# EasyEDA Pro project jlcProject.epro, board PCB1_1
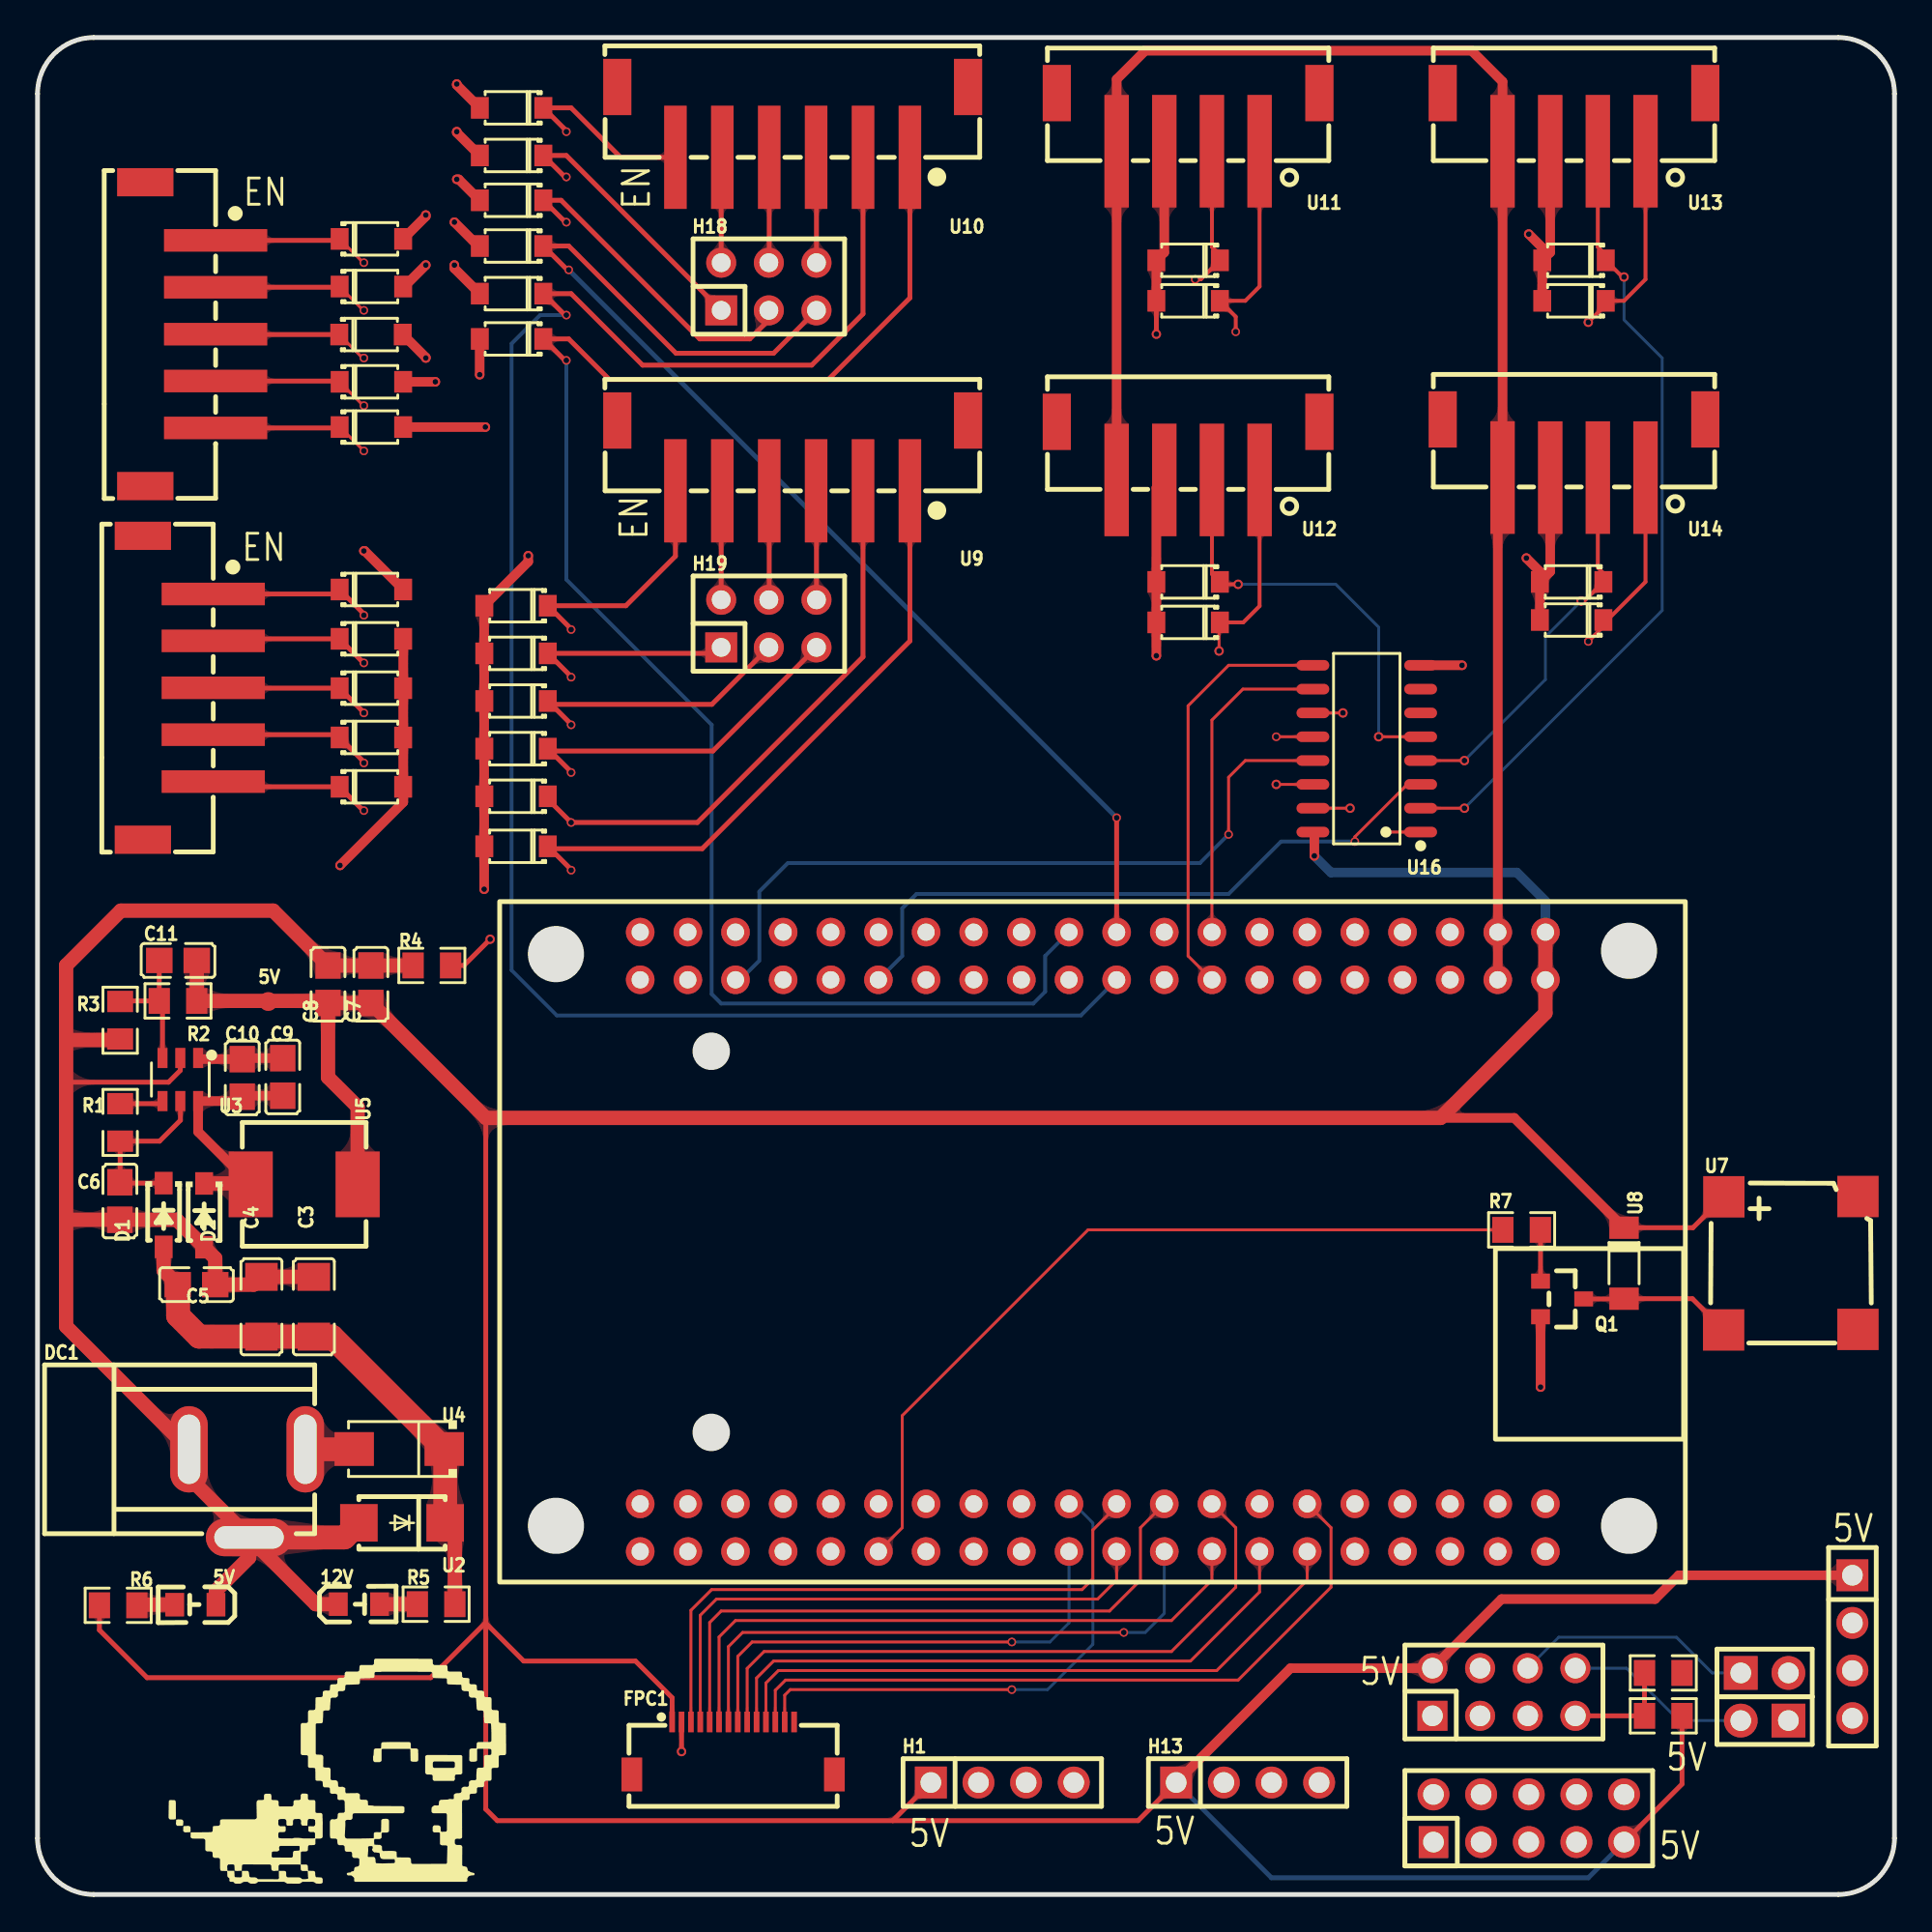
[diagram p13: board, top side]
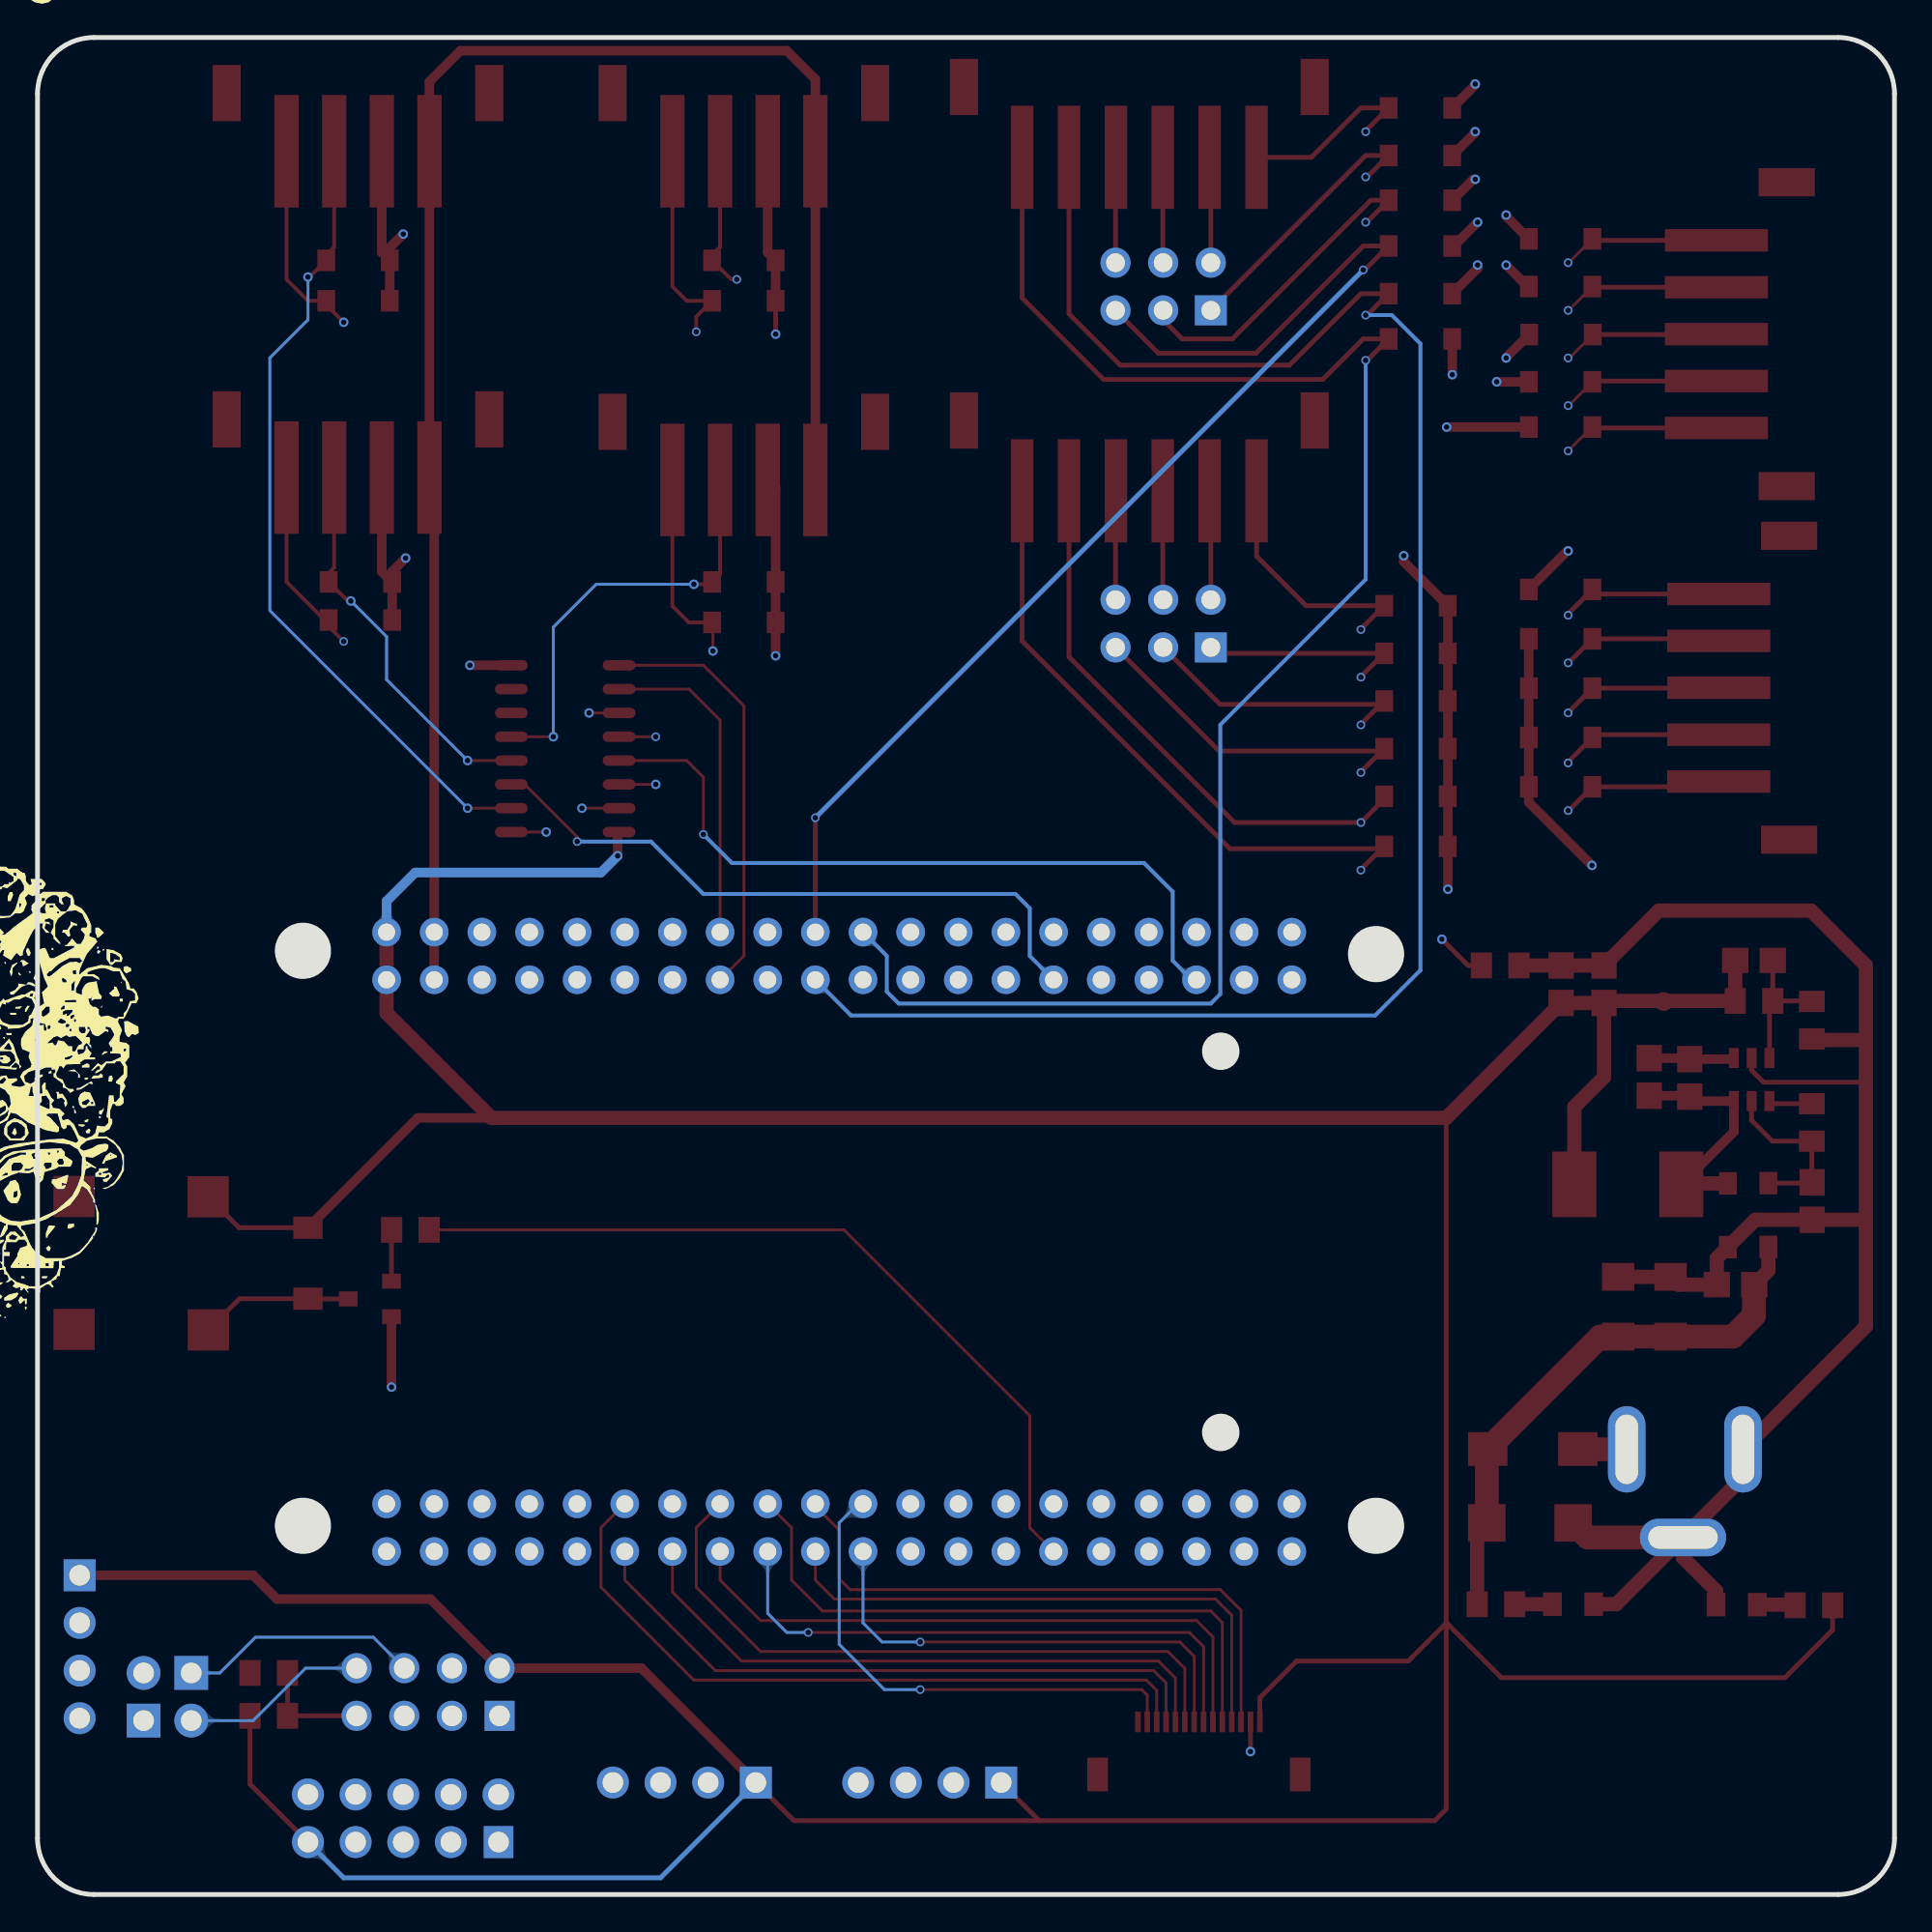
[diagram p14: board, bottom side, seen from below]

Outline 99 x 99 mm; copper layers: Top Layer, Inner1, Inner2, Bottom Layer. Coordinates in mm from the lower left corner of the outline.
Outline path: 0,96 0,3 arc(0.88,0.88) 3,0 96,0 arc(98.12,0.88) 99,3 99,96 arc(98.12,98.12) 96,99 3,99 arc(0.88,98.12) 0,96
Stack: Top Layer 0.035mm 外层铜厚1oz / Dielectric1 0.2104mm 7628 RC49% 8.6mil / Inner1 0.0152mm 内层铜厚 / Dielectric2 1.065mm 1.1mm H/HOZ 含铜 / Inner2 0.0152mm 内层铜厚 / Dielectric3 0.2104mm 7628 RC49% 8.6mil / Bottom Layer 0.035mm 外层铜厚1oz

## Design rules (mm)
template: 自定义配置
spacing copperThickness1oz (default): track to track 0.102, other pairs 0.152 to 0.3
spacing copperThickness2oz: track to track 0.203, other pairs 0.152 to 0.3
track width copperThickness1oz (default): min 0.127, default 0.254, max 2.54
track width copperThickness2oz: min 0.203, default 0.254, max 2.54
differential pair differentialPair (default): width min 0.127, default 0.254, max 2.54; gap min 0.152, default 0.152
via viaSize (default): diameter min 0.5, default 0.61, max 10; hole min 0.3, default 0.305, max 6.299
via viaSize1: diameter min 0.127, default 0.305, max 10; hole min 0.102, default 0.457, max 6.299
net D2 uses viaSize1
net C10 uses viaSize1
net C8 uses viaSize1
net B4 uses viaSize1
net D7 uses viaSize1
net D5 uses viaSize1
net D0 uses viaSize1
net C0 uses viaSize1
net C2 uses viaSize1
net A10 uses viaSize1
net A11 uses viaSize1
net C12 uses viaSize1
net C11 uses viaSize1
net C9 uses viaSize1
net E3 uses viaSize1
net A8 uses viaSize1
net B5 uses viaSize1
net B3 uses viaSize1
net D6 uses viaSize1
net D4 uses viaSize1
net D1 uses viaSize1
net C1 uses viaSize1
net C3 uses viaSize1
net A9 uses viaSize1
net A12 uses viaSize1
net A0 uses viaSize1
net A2 uses viaSize1
net C4 uses viaSize1
net B0 uses viaSize1
net E9 uses viaSize1
net E11 uses viaSize1
net E13 uses viaSize1
net B11 uses viaSize1
net B13 uses viaSize1
net B15 uses viaSize1
net D9 uses viaSize1
net A1 uses viaSize1
net A3 uses viaSize1
net A5 uses viaSize1
net A7 uses viaSize1
net C5 uses viaSize1
net B1 uses viaSize1
net E8 uses viaSize1
net E10 uses viaSize1
net E12 uses viaSize1
net E14 uses viaSize1
net B10 uses viaSize1
net B12 uses viaSize1
net B14 uses viaSize1
net D8 uses viaSize1
net CTP_INT uses viaSize1
net A15 uses viaSize1
net WIFI_TXD uses viaSize1
net WIFI_CS uses viaSize1
net WIFI_RXD uses viaSize1
net MOTOR1_M1 uses viaSize1
net MOTOR1_M0 uses viaSize1
net MOTOR1_M2 uses viaSize1
net MOTOR2_M1 uses viaSize1
net MOTOR2_M0 uses viaSize1
net MOTOR2_M2 uses viaSize1
net 1Y0 uses viaSize1
net 2Y0 uses viaSize1
net D10 uses viaSize1
net 1Y2 uses viaSize1
net 1Y3 uses viaSize1
net 1Y1 uses viaSize1
net 2Y2 uses viaSize1
net 2Y1 uses viaSize1
net 2Y3 uses viaSize1

## Placement (name value [footprint] x y rotation side)
5V  -  [LED_0805]  8.36 15.46 180 top
5V#2  -  [Mark-Point-1mm]  12.3 47.61 270 top
12V  -  [LED_0805]  17.19 15.47 0 top
C3  100uf  [C1206]  14.73 31.33 270 top
C4  100uf  [C1206]  11.94 31.33 270 top
C5  100nF  [C0805]  8.47 32.51 180 top
C6  10uF  [C0805]  4.39 36.97 270 top
C7  10uF  [C0805]  17.77 48.53 270 top
C8  100nF  [C0805]  15.49 48.53 270 top
C9  100nF  [C0805]  13.07 43.58 270 top
C10  100nF  [C0805]  10.92 43.53 270 top
C11  100pF  [C0805]  7.49 49.8 0 top
CN1  ZX-XH2.54-5PLT  [CONN-SMD_5P-P2.50_ZX-XH2.54-5PLT]  7.49 64.33 270 top
CN2  ZX-XH2.54-5PLT  [CONN-SMD_5P-P2.50_ZX-XH2.54-5PLT]  7.62 83.19 270 top
D1  B5819W SL  [SOD-123_L2.7-W1.6-LS3.7-RD-1]  6.72 36.22 270 top
D2  B5819W SL  [SOD-123_L2.7-W1.6-LS3.7-RD-1]  8.88 36.21 270 top
D3  SMF3.3A  [SOD-123_L2.8-W1.8-LS3.7-RD]  25.51 55.88 180 top
D4  SMF3.3A  [SOD-123_L2.8-W1.8-LS3.7-RD]  25.51 58.55 180 top
D5  SMF3.3A  [SOD-123_L2.8-W1.8-LS3.7-RD]  25.51 61.09 180 top
D6  SMF3.3A  [SOD-123_L2.8-W1.8-LS3.7-RD]  25.27 82.93 180 top
D7  SMF3.3A  [SOD-123_L2.8-W1.8-LS3.7-RD]  25.27 85.34 180 top
D8  SMF3.3A  [SOD-123_L2.8-W1.8-LS3.7-RD]  25.27 87.88 180 top
D21  SMF3.3A  [SOD-123_L2.8-W1.8-LS3.7-RD]  25.51 63.63 180 top
D22  SMF3.3A  [SOD-123_L2.8-W1.8-LS3.7-RD]  25.51 66.17 180 top
D23  SMF3.3A  [SOD-123_L2.8-W1.8-LS3.7-RD]  25.51 68.71 180 top
D24  SMF3.3A  [SOD-123_L2.8-W1.8-LS3.7-RD]  25.27 90.32 180 top
D25  SMF3.3A  [SOD-123_L2.8-W1.8-LS3.7-RD]  25.27 92.71 180 top
D26  SMF3.3A  [SOD-123_L2.8-W1.8-LS3.7-RD]  25.27 95.25 180 top
D27  SMF3.3A  [SOD-123_L2.8-W1.8-LS3.7-RD]  17.8 69.57 0 top
D28  SMF3.3A  [SOD-123_L2.8-W1.8-LS3.7-RD]  17.8 66.94 0 top
D29  SMF3.3A  [SOD-123_L2.8-W1.8-LS3.7-RD]  17.8 64.31 0 top
D30  SMF3.3A  [SOD-123_L2.8-W1.8-LS3.7-RD]  17.8 61.68 0 top
D31  SMF3.3A  [SOD-123_L2.8-W1.8-LS3.7-RD]  17.8 59.06 0 top
D32  SMF3.3A  [SOD-123_L2.8-W1.8-LS3.7-RD]  17.8 88.27 0 top
D33  SMF3.3A  [SOD-123_L2.8-W1.8-LS3.7-RD]  17.8 85.72 0 top
D34  SMF3.3A  [SOD-123_L2.8-W1.8-LS3.7-RD]  17.78 83.17 0 top
D35  SMF3.3A  [SOD-123_L2.8-W1.8-LS3.7-RD]  17.8 80.64 0 top
D36  SMF3.3A  [SOD-123_L2.8-W1.8-LS3.7-RD]  17.8 78.23 0 top
D37  SMF3.3A  [SOD-123_L2.8-W1.8-LS3.7-RD]  61.34 84.96 180 top
D38  SMF3.3A  [SOD-123_L2.8-W1.8-LS3.7-RD]  61.34 87.12 180 top
D39  SMF3.3A  [SOD-123_L2.8-W1.8-LS3.7-RD]  61.34 67.82 180 top
D40  SMF3.3A  [SOD-123_L2.8-W1.8-LS3.7-RD]  61.34 69.98 180 top
D41  SMF3.3A  [SOD-123_L2.8-W1.8-LS3.7-RD]  81.91 84.96 180 top
D42  SMF3.3A  [SOD-123_L2.8-W1.8-LS3.7-RD]  81.91 87.12 180 top
D43  SMF3.3A  [SOD-123_L2.8-W1.8-LS3.7-RD]  81.79 67.94 180 top
D44  SMF3.3A  [SOD-123_L2.8-W1.8-LS3.7-RD]  81.79 69.98 180 top
DC1  DC005  [DC-IN-TH_DC005]  11.18 21.38 0 top
FPC1  FPC-05F-14PH15  [FPC-SMD_14P-P0.50_XUNPU_FPC-05F-14PH15]  37.08 7.8 0 top
H1  -  [HDR-TH_4P-P2.54-V-F]  51.44 5.97 0 top
H2  -  [HDR-TH_8P-P2.54-V-F-R2-C4-S2.54-1]  78.18 10.79 0 top
H4  -  [HDR-TH_2P-P2.54-V-M-1]  92.07 9.27 180 top
H5  -  [HDR-TH_2P-P2.54-V-M-1]  92.07 11.81 0 top
H12  -  [HDR-TH_4P-P2.54-V-F]  96.76 13.21 270 top
H13  -  [HDR-TH_4P-P2.54-V-F]  64.52 5.97 0 top
H14  -  [HDR-TH_10P-P2.54-V-F-R2-C5-S2.54]  79.5 4.06 0 top
H18  -  [HDR-TH_6P-P2.54-V-F-R2-C3-S2.54]  38.99 85.72 0 top
H19  -  [HDR-TH_6P-P2.54-V-F-R2-C3-S2.54]  38.99 67.75 0 top
Q1  -  [S8050_SOT-23]  81.28 31.88 180 top
R1  1M  [R0805]  4.41 41.16 90 top
R2  10K  [R0805]  7.49 47.64 0 top
R3  1.8K  [R0805]  4.41 46.61 90 top
R4  0  [R0805]  21.02 49.53 0 top
R5  1.2K  [R0805]  21.25 15.48 180 top
R6  510  [R0805]  4.3 15.42 0 top
R7  470  [R0805]  79.12 35.43 0 top
R8  10K  [R0805]  86.67 11.81 0 top
R9  10K  [R0805]  86.67 9.53 0 top
U1  -  [STM32H750VBT6]  24.64 16.66 0 top
U2  SMAJ15A  [DO-214AC_L4.6-W2.8-LS5.6-RD]  19.43 19.81 180 top
U3  ME3116AM6G  [SOT-23-6_L2.9-W1.6-P0.95-LS2.8-BL]  7.61 43.45 180 top
U4  SS54  [SMA_L4.2-W2.6-LS5.1-RD]  19.28 23.75 180 top
U5  6.8uH  [IND-SMD_L7.2-W6.6_GPSR07X0]  14.22 37.86 0 top
U7  MLT-8530-5V  [BUZ-SMD_4P-L8.5-W8.5-TL]  93.47 33.66 0 top
U8  LL4148  [LL-34_L3.5-W1.5-R-RD]  84.58 33.66 270 top
U9  ZX-XH2.54-6PLT  [CONN-SMD_6P-P2.50_ZX-XH2.54-6PLT]  40.26 76.71 180 top
U10  ZX-XH2.54-6PLT  [CONN-SMD_6P-P2.50_ZX-XH2.54-6PLT]  40.26 94.49 180 top
U11  ZX-XH2.54-4PLT  [CONN-SMD_4P-P2.54_C9900012758]  61.34 94.49 180 top
U12  ZX-XH2.54-4PLT  [CONN-SMD_4P-P2.54_C9900012758]  61.34 76.96 180 top
U13  ZX-XH2.54-4PLT  [CONN-SMD_4P-P2.54_C9900012758]  81.91 94.49 180 top
U14  ZX-XH2.54-4PLT  [CONN-SMD_4P-P2.54_C9900012758]  81.91 77.09 180 top
U16  74HC4052  [SOP-16_L10.0-W3.9-P1.27-LS6.0-BL]  70.87 61.09 90 top

## Footprints (pads in the part's own frame, mm; a bottom-side part is the same pattern mirrored in y, then rotated)
BUZ-SMD_4P-L8.5-W8.5-TL
  rect 2.2x2.2 smd: 1(-3.568,3.541) 2(-3.581,-3.557) 3(3.58,-3.528) 4(3.581,3.557)
C0805
  rect 1.41x1.35 smd: 1(-1,0) 2(1,0)
C1206
  rect 1.485x1.728 smd: 1(-1.593,0) 2(1.593,0)
CONN-SMD_4P-P2.54_C9900012758
  rect 1.3x6 smd: 1(-3.811,1.55) 2(-1.27,1.55) 3(1.27,1.55) 4(3.81,1.55)
  rect 1.5x3 smd: 5(7,-1.55) 6(-7,-1.55)
CONN-SMD_5P-P2.50_ZX-XH2.54-5PLT
  rect 1.2x5.5 smd: 1(-5,1.875) 2(-2.5,1.875) 3(0,1.875) 4(2.5,1.875) 5(5,1.875)
  rect 1.5x3 smd: 6(8.1,-1.875) 7(-8.1,-1.875)
CONN-SMD_6P-P2.50_ZX-XH2.54-6PLT
  rect 1.2x5.5 smd: 1(-6.25,1.875) 2(-3.75,1.875) 3(-1.25,1.875) 4(1.25,1.875) 5(3.75,1.875) 6(6.25,1.875)
  rect 1.5x3 smd: 7(9.35,-1.875) 8(-9.35,-1.875)
DC-IN-TH_DC005
  oval 2x4.6 hole 1.2x3.7: 1(3.1,2.35) 2(-3.1,2.35)
  oval 4.6x2 hole 3.7x1.2: 3(0.1,-2.35)
DO-214AC_L4.6-W2.8-LS5.6-RD
  rect 2x2 smd: 1(-2.3,0) 2(2.3,0)
FPC-SMD_14P-P0.50_XUNPU_FPC-05F-14PH15
  rect 0.3x1.1 smd: 1(-3.25,1.4) 2(-2.75,1.4) 3(-2.25,1.4) 4(-1.75,1.4) 5(-1.25,1.4) 6(-0.75,1.4) 7(-0.25,1.4) 8(0.25,1.4) 9(0.75,1.4) 10(1.25,1.4) 11(1.75,1.4) 12(2.25,1.4) 13(2.75,1.4) 14(3.25,1.4)
  rect 1.1x1.8 smd: 15(5.4,-1.4) 16(-5.4,-1.4)
HDR-TH_2P-P2.54-V-M-1
  rect 1.8x1.8 hole 1.1: 1(-1.27,0)
  round 1.8 hole 1.1: 2(1.27,0)
HDR-TH_4P-P2.54-V-F
  rect 1.7x1.7 hole 1.1: 1(-3.81,0)
  round 1.7 hole 1.1: 2(-1.27,0) 3(1.27,0) 4(3.81,0)
HDR-TH_6P-P2.54-V-F-R2-C3-S2.54
  rect 1.7x1.6 hole 1: 1(-2.54,-1.27)
  round 1.6 hole 1: 2(-2.54,1.27) 3(0,-1.27) 4(0,1.27) 5(2.54,-1.27) 6(2.54,1.27)
HDR-TH_8P-P2.54-V-F-R2-C4-S2.54-1
  rect 1.6x1.6 hole 1.1: 1(-3.81,-1.27)
  round 1.6 hole 1.1: 2(-3.81,1.27) 3(-1.27,-1.27) 4(-1.27,1.27) 5(1.27,-1.27) 6(1.27,1.27) 7(3.81,-1.27) 8(3.81,1.27)
HDR-TH_10P-P2.54-V-F-R2-C5-S2.54
  rect 1.575x1.7 hole 1.1: 1(-5.08,-1.27)
  round 1.7 hole 1.1: 2(-5.08,1.27) 3(-2.54,-1.27) 4(-2.54,1.27) 5(0,-1.27) 6(0,1.27) 7(2.54,-1.27) 8(2.54,1.27) 9(5.08,-1.27) 10(5.08,1.27)
IND-SMD_L7.2-W6.6_GPSR07X0
  rect 2.35x3.5 smd: 1(-2.85,0) 2(2.85,0)
LED_0805
  rect 1x1.25 smd: 1(-1.15,0.005) 2(1.05,0.005)
LL-34_L3.5-W1.5-R-RD
  rect 1.185x1.566 smd: 1(1.893,0) 2(-1.893,0)
Mark-Point-1mm
  round 1 smd: 1(0,0)
R0805
  rect 1.133x1.377 smd: 1(-1,0) 2(1,0)
S8050_SOT-23
  rect 1x0.8 smd: 1(1.15,-0.823) 2(1.15,1.077) 3(-1.15,0.127)
SMA_L4.2-W2.6-LS5.1-RD
  rect 2.1x1.8 smd: 1(-2.4,0) 2(2.4,0)
SOD-123_L2.7-W1.6-LS3.7-RD-1
  rect 1.2x0.95 smd: 1(-1.7,0) 2(1.7,0)
SOD-123_L2.8-W1.8-LS3.7-RD
  rect 0.95x1.15 smd: 1(-1.692,0) 2(1.692,0)
SOP-16_L10.0-W3.9-P1.27-LS6.0-BL
  oval 0.56x1.745 smd: 1(-4.445,-2.873) 2(-3.175,-2.873) 3(-1.905,-2.873) 4(-0.635,-2.873) 5(0.635,-2.873) 6(1.905,-2.873) 7(3.175,-2.873) 8(4.445,-2.873) 9(4.445,2.873) 10(3.175,2.873) 11(1.905,2.873) 12(0.635,2.873) 13(-0.635,2.873) 14(-1.905,2.873) 15(-3.175,2.873) 16(-4.445,2.873)
SOT-23-6_L2.9-W1.6-P0.95-LS2.8-BL
  rect 0.532x1.072 smd: 1(-0.95,-1.149) 2(0,-1.149) 3(0.95,-1.149) 4(0.95,1.149) 5(0,1.149) 6(-0.95,1.149)
STM32H750VBT6
  round 1.524 hole 0.914: 1(7.493,1.63) 2(10.033,1.63) 3(12.573,1.63) 4(15.113,1.63) 5(17.653,1.63) 6(20.193,1.63) 7(22.733,1.63) 8(25.273,1.63) 9(27.813,1.63) 10(30.353,1.63) 11(32.893,1.63) 12(35.433,1.63) 13(37.973,1.63) 14(40.513,1.63) 15(43.053,1.63) 16(45.593,1.63) 17(48.133,1.63) 18(50.673,1.63) 19(53.213,1.63) 20(55.753,1.63) 21(55.753,4.17) 22(53.213,4.17) 23(50.673,4.17) 24(48.133,4.17) 25(45.593,4.17) 26(43.053,4.17) 27(40.513,4.17) 28(37.973,4.17) 29(35.433,4.17) 30(32.893,4.17) 31(30.353,4.17) 32(27.813,4.17) 33(25.273,4.17) 34(22.733,4.17) 35(20.193,4.17) 36(17.653,4.17) 37(15.113,4.17) 38(12.573,4.17) 39(10.033,4.17) 40(7.493,4.17) 41(7.493,34.65) 42(10.033,34.65) 43(12.573,34.65) 44(15.113,34.65) 45(17.653,34.65) 46(20.193,34.65) 47(22.733,34.65) 48(25.273,34.65) 49(27.813,34.65) 50(30.353,34.65) 51(32.893,34.65) 52(35.433,34.65) 53(37.973,34.65) 54(40.513,34.65) 55(43.053,34.65) 56(45.593,34.65) 57(48.133,34.65) 58(50.673,34.65) 59(53.213,34.65) 60(55.753,34.65) 61(55.753,32.11) 62(53.213,32.11) 63(50.673,32.11) 64(48.133,32.11) 65(45.593,32.11) 66(43.053,32.11) 67(40.513,32.11) 68(37.973,32.11) 69(35.433,32.11) 70(32.893,32.11) 71(30.353,32.11) 72(27.813,32.11) 73(25.273,32.11) 74(22.733,32.11) 75(20.193,32.11) 76(17.653,32.11) 77(15.113,32.11) 78(12.573,32.11) 79(10.033,32.11) 80(7.493,32.11)

## Nets
As in the schematic, except:
5V: 5V#2.1 C7.2 C8.2 C11.2 FPC1.1 H1.1 H2.2 H12.1 H13.1 H14.9 R2.2 R6.1 R9.2 U1.60 U1.61 U5.2 U7.1 U8.2 U16.16
AGND: 5V.1 12V.1 C3.1 C4.1 C5.1 C6.2 C7.1 C8.1 D2.2 DC1.2 DC1.3 R3.1 R4.1 U2.2 U3.2
GND: D3.2 D4.2 D5.2 D6.2 D7.2 D8.2 D21.2 D22.2 D23.2 D24.2 D25.2 D26.2 D27.2 D28.2 D29.2 D30.2 D31.2 D32.2 D33.2 D34.2 D35.2 D36.2 D37.2 D38.2 D39.2 D40.2 D41.2 D42.2 D43.2 D44.2 FPC1.2 H1.2 H2.4 H12.2 H13.2 H14.7 H14.8 Q1.2 R4.2 R8.2 U1.20 U1.21 U11.3 U12.3 U13.3 U14.3 U16.6 U16.7 U16.8
1Y0: D38.1 U11.2 U16.1
1Y1: D40.1 U12.2 U16.5
1Y2: D42.1 U13.2 U16.2
1Y3: D44.1 U14.2 U16.4
2Y0: D37.1 U11.1 U16.12
2Y1: D39.1 U12.1 U16.14
2Y2: D41.1 U13.1 U16.15
2Y3: D43.1 U14.1 U16.11
A8: U1.75 U16.3
C9: U1.78 U16.13
D0: U1.53 U16.10
D1: U1.68 U16.9
$1N4630: 5V.2 R6.2

Pads without a net: CN1 6 7; CN2 6 7; FPC1 14 15 16; H14 2; U1 1 2 3 22 27 34 35 38 39 40 44 45 46 47 48 52 57 64 73 74 76; U7 3 4; U9 7 8; U10 7 8; U11 5 6; U12 5 6; U13 5 6; U14 5 6

## Via types
v1: diameter 0.457, hole 0.305, Top Layer to Bottom Layer, 32 vias
v2: diameter 0.5, hole 0.305, Top Layer to Bottom Layer, 18 vias
v3: diameter 0.5, hole 0.299, Top Layer to Bottom Layer, 18 vias

## Routing (per net, layer and track width the routed paths; a pad name or vN(x,y) marks a point on that pad's centre or on a via; arc(x,y) is an arc through that point)
3.3V: length 91.2
  Top Layer w0.508: U1.62 U1.59 77.85,75.28 U14.4 U13.4 78.1,96.65 76.45,98.3 59.06,98.3 57.53,96.77 U11.4 U12.4
5V: length 318.1
  Top Layer w0.254: U7.1 88.25,35.55 U8.2 ; 45.59,3.94 24.51,3.94 23.9,4.55 23.9,14.47 ; 45.59,3.94 58.67,3.94 H13.1 ; 45.59,3.94 H1.1 ; FPC1.1 33.83,10.49 31.88,12.45 25.92,12.45 23.9,14.47 ; 23.9,41.4 23.9,14.47 ; 23.9,14.47 23.86,14.47 20.95,11.56 5.84,11.56 3.3,14.1 R6.1 ; H14.9 87.67,5.88 R9.2
  Top Layer w0.508: H13.1 66.8,12.06 H2.2 78.05,15.75 86.23,15.75 87.5,17.02 H12.1 ; U8.2 78.73,41.4 74.8,41.4 ; v2(68.07,55.37) 68.07,56.62
  Top Layer w0.762: U1.60 U1.61 80.39,46.99 74.8,41.4 23.9,41.4 C7.2 C8.2 ; U5.2 17.07,41.99 15.49,43.57 C8.2 ; C8.2 15.38,47.64 R2.2 C11.2
  Bottom Layer w0.254: H14.9 82.68,0.89 65.79,0.89 H13.1
  Bottom Layer w0.508: U1.60 80.39,52.96 78.87,54.48 68.96,54.48 v2(68.07,55.37)
12V: length 29.6
  Top Layer w0.762: R5.1 22.25,19.3 U2.1 ; D1.2 6.72,33.26 C5.2
  Top Layer w1.27: U2.1 21.73,23.7 U4.1 15.69,29.74 C3.2 C4.2 8.61,29.74 7.49,30.86 7.49,32.49 C5.2
AGND: length 97.7
  Top Layer w0.254: 1.52,43.3 6.98,43.3 7.61,43.93 U3.2
  Top Layer w0.762: DC1.3 8.08,22.23 DC1.2 1.52,30.29 1.52,36 ; DC1.3 11.28,17.96 9.51,16.19 5V.1 ; DC1.3 14.83,15.48 12V.1 ; R4.1 20.02,49.53 C7.1 C8.1 12.56,52.45 4.44,52.45 1.52,49.53 1.52,45.55 ; R3.1 4.35,45.55 1.52,45.55 ; 1.52,45.55 1.52,36 ; C3.1 C4.1 11.52,32.51 C5.1 9.47,33.92 D2.2 7.42,35.97 C6.2 1.55,35.97 1.52,36
  Top Layer w1.27: DC1.3 16.36,19.03 17.13,19.81
GND: length 106.6
  Top Layer w0.254: D37.2 v2(59.65,83.19) ; FPC1.2 v3(34.33,7.62) ; R4.2 22.73,49.53 v3(24.13,50.93)
  Top Layer w0.508: D42.2 80.65,87.54 U13.3 ; D42.2 80.22,87.8 v2(79.5,88.52) ; D42.2 D41.2 ; D43.2 D44.2 ; D44.2 80.1,70.53 v2(79.38,71.25) ; D44.2 80.65,70.53 U14.3 ; v3(16.13,54.86) 19.5,58.23 19.5,66.94 ; v3(22.35,93.98) 22.35,93.93 23.57,92.71 ; 23.57,90.32 22.46,91.44 v3(22.35,91.44) ; 19.5,88.27 20.7,89.47 v3(20.7,89.53) ; 19.48,83.17 20.7,81.94 v3(20.7,81.92) ; v3(23.81,53.59) 23.81,68.71 26.16,71.06 v3(26.16,71.37) ; 23.57,95.25 22.35,96.47 v3(22.35,96.52) ; v2(59.65,66.04) D39.2 D40.2 59.65,74.99 U12.3 ; 19.5,78.23 v3(23.88,78.23) ; 23.57,85.34 22.22,86.69 v3(22.22,86.87) ; D37.2 D38.2 60.07,87.54 U11.3 ; 73.63,65.53 v2(75.95,65.53) ; Q1.2 v3(80.13,27.05) ; 19.5,85.72 19.56,85.72 v3(20.7,86.87) ; 19.5,80.64 v3(21.21,80.64) ; 23.57,87.88 23.5,87.88 v3(22.22,89.15) ; v3(17.4,71.63) 17.44,71.63 19.5,69.57 ; 23.57,82.93 v3(23.57,81.03)
1Y0: length 47
  Top Layer w0.152: v2(71.88,56.64) U16.1
  Top Layer w0.203: U11.2 62.61,87.83 63.03,87.41 D38.1 62.02,86.11 v1(61.72,86.11)
  Inner2 w0.152: v1(61.72,86.11) 61.09,85.47 61.09,61.98 66.42,56.64 v2(71.88,56.64)
1Y1: length 23.2
  Top Layer w0.152: U16.5 v2(71.5,61.72)
  Top Layer w0.203: v2(64.01,69.85) 63.16,69.85 D40.1 62.61,70.4 U12.2
  Bottom Layer w0.152: v2(64.01,69.85) 69.22,69.85 71.5,67.56 v2(71.5,61.72)
1Y2: length 43.2
  Top Layer w0.152: U16.2 v2(76.07,57.91)
  Top Layer w0.203: U13.2 83.19,87.83 83.61,87.41 D42.1 84.5,86.23 v2(84.58,86.23)
  Bottom Layer w0.152: v2(84.58,86.23) 84.58,83.95 86.61,81.92 86.61,68.45 v2(76.07,57.91)
1Y3: length 20.7
  Top Layer w0.152: U16.4 v2(76.07,60.45)
  Top Layer w0.203: U14.2 83.19,70.74 83.48,70.44 D44.1 82.46,68.96 v2(82.3,68.96)
  Bottom Layer w0.152: v2(76.07,60.45) 80.39,64.77 80.39,67.06 v2(82.3,68.96)
2Y0: length 36.1
  Top Layer w0.152: U16.12 v1(66.04,61.72)
  Top Layer w0.203: U11.1 65.15,85.73 64.39,84.96 D37.1 63.88,84.12 v1(63.88,83.31)
  Inner1 w0.152: v1(63.88,83.31) 63.88,74.51 65.15,73.24 65.15,62.61 v1(66.04,61.72)
2Y1: length 21.1
  Top Layer w0.152: U16.14 v2(66.04,59.18) ; D39.1 62.99,67.78 v2(62.99,66.29)
  Top Layer w0.203: D39.1 64.28,67.82 65.15,68.69 U12.1
  Inner1 w0.152: v2(62.99,66.29) 62.99,62.23 v2(66.04,59.18)
2Y2: length 46.5
  Top Layer w0.152: v2(69.98,57.91) U16.15
  Top Layer w0.203: v2(82.68,83.82) 83.61,84.75 D41.1 84.58,84.96 85.72,86.11 85.72,92.94
  Inner1 w0.152: v2(82.68,83.82) 78.61,83.82 70.36,75.56 70.36,58.29 v2(69.98,57.91)
2Y3: length 26
  Top Layer w0.152: v2(69.6,62.99) U16.11
  Top Layer w0.203: 85.72,75.54 85.72,69.98 83.69,67.94 D43.1 ; v1(82.68,66.8) 83.48,67.61
  Inner2 w0.152: v1(82.68,66.8) 78.87,62.99 v2(69.6,62.99)
A0: length 54.9
  Top Layer w0.254: v1(17.4,57.78) 17.37,57.78 16.1,59.06 9.65,59.06 CN1.5
  Inner1 w0.254: v1(17.4,57.78) 17.4,46.74 39.75,24.38 U1.37
A1: length 61
  Top Layer w0.254: CN1.4 15.95,61.83 17.4,60.38 v1(17.4,60.33)
  Inner1 w0.254: U1.4 41.02,19.56 41.02,24.64 18.16,47.5 18.16,59.56 v1(17.4,60.33)
A2: length 61.1
  Top Layer w0.254: CN1.3 9.39,64.31 16.1,64.31 17.4,63.01 v1(17.4,62.99)
  Inner1 w0.254: U1.36 42.29,24.64 19.05,47.88 19.05,61.34 v1(17.4,62.99)
A3: length 67.4
  Top Layer w0.254: v1(17.4,65.66) 17.38,65.66 16.1,66.94 9.48,66.94 CN1.2
  Inner1 w0.254: U1.5 42.41,18.28 43.56,19.43 43.56,24.77 20.07,48.26 20.07,62.99 v1(17.4,65.66)
A5: length 115
  Top Layer w0.152: R7.1 56.01,35.43 46.1,25.53 46.1,19.56 U1.6
  Top Layer w0.254: CN1.1 15.86,69.33 16.1,69.57 17.4,68.27 v1(17.4,68.2)
  Inner1 w0.254: v1(17.4,68.2) 20.95,64.64 20.95,48.89 46.1,23.75 46.1,19.56 U1.6
A7: length 81.8
  Top Layer w0.152: v1(17.4,76.96) 16.13,78.23 16.1,78.23 16.05,78.19
  Top Layer w0.254: 16.05,78.19 CN2.5
  Inner2 w0.254: U1.7 46.23,19.43 46.23,22.1 44.58,23.75 40.77,23.75 18.8,45.72 18.8,75.56 v1(17.4,76.96)
A8: length 34.9
  Top Layer w0.152: v1(70.23,56.13) 70.23,56.39 73.03,59.18 U16.3
  Bottom Layer w0.203: v1(70.23,56.13) 66.29,56.13 63.5,53.34 46.86,53.34 46.1,52.58 46.1,50.03 U1.75
A9: length 43.6
  Inner2 w0.152: H13.4 68.33,8.57 68.96,9.2 68.96,28.32 70.23,29.59 U1.65
A10: length 48.1
  Inner1 w0.152: H13.3 65.79,5.21 65.91,5.08
  Inner2 w0.152: U1.56 68.96,50.03 68.96,45.59 66.42,43.05 66.42,9.4 65.79,8.76 H13.3
A11: length 54.7
  Inner1 w0.152: U1.58 75.31,51.31 74.04,50.04 74.04,46.86 53.72,26.54 53.72,8.89 52.71,7.87 H1.3
A12: length 51.1
  Inner1 w0.152: H1.4 55.25,7.75 56.13,8.64 56.13,25.02 75.31,44.2 U1.63
A15: length 14.7
  Inner2 w0.152: U1.19 77.85,18.28 80.77,15.37 80.77,6.6 H14.6
B0: length 85.3
  Top Layer w0.152: 16.06,80.69 17.37,79.38 v1(17.4,79.38)
  Top Layer w0.254: CN2.4 16.06,80.69
  Inner2 w0.254: U1.32 48.13,25.15 41.66,25.15 20.32,46.48 20.32,76.45 v1(17.4,79.38)
B1: length 91.7
  Top Layer w0.152: 16.08,83.17 17.33,81.92 v1(17.4,81.92) ; 9.51,83.17 CN2.3
  Top Layer w0.254: 16.08,83.17 9.51,83.17
  Inner2 w0.254: v1(17.4,81.92) 21.72,77.6 21.72,47.62 42.8,26.54 49.78,26.54 53.72,22.61 53.72,19.56 U1.9
B3: length 72.1
  Top Layer w0.254: v1(28.19,93.98) 28.19,94.03 26.97,95.25 28.45,95.25 31.09,92.61 U10.6
  Inner1 w0.254: v1(28.19,93.98) 32.77,89.41 32.77,62.99 34.67,61.09 44.7,61.09 53.72,52.07 53.72,50.03 U1.71
B4: length 72.1
  Top Layer w0.254: v1(28.19,89.15) 28.14,89.15 26.97,90.32 27.91,90.32 35.31,82.93 37.97,82.93 38.99,83.95 H18.3
  Inner1 w0.254: U1.49 52.33,51.31 43.43,60.2 32.51,60.2 31.62,61.09 31.62,85.72 v1(28.19,89.15)
B5: length 73.3
  Top Layer w0.254: H18.1 28.19,92.71 26.97,92.71 28.12,91.57 v1(28.19,91.57)
  Inner2 w0.254: U1.72 51.18,50.03 51.18,52.32 49.53,53.97 39.5,53.97 33.15,60.33 33.15,86.61 v1(28.19,91.57)
B10: length 33.2
  Top Layer w0.152: U1.14 65.15,16.13 61.47,12.45 39.24,12.45 38.33,11.54 FPC1.10
B11: length 38.6
  Top Layer w0.152: U1.26 68.96,19.56 68.96,16.38 64.01,11.43 39.88,11.43 39.33,10.89 FPC1.12
B12: length 34.7
  Top Layer w0.152: U1.15 67.69,16.76 62.87,11.94 39.5,11.94 38.83,11.28 FPC1.11
B13: length 22.5
  Inner1 w0.152: 75.69,10.74 75.69,12.83 71.5,17.02 71.5,19.56 U1.25 ; 75.69,10.74 H2.3 ; 75.69,10.74 75.69,4.06 H14.3
B14: length 23.1
  Inner1 w0.152: H14.1 70.23,6.99 70.23,13.66 ; H2.1 70.23,13.66 ; 70.23,13.66 U1.16
B15: length 22.5
  Inner2 w0.152: 78.23,10.74 78.23,4.19 79.5,2.92 H14.5 ; 78.23,10.74 H2.5 ; 78.23,10.74 78.23,12.83 74.04,17.02 74.04,19.56 72.77,20.82 U1.24
C4: length 85.5
  Top Layer w0.152: v1(17.4,84.45) 17.37,84.45 16.1,85.72 16.06,85.69
  Top Layer w0.254: CN2.2 16.06,85.69
  Inner1 w0.254: U1.33 49.91,21.46 21.72,49.66 21.72,78.61 17.4,82.93 v1(17.4,84.45)
C5: length 91.8
  Top Layer w0.152: 16.1,88.27 17.37,87 v1(17.4,87) ; 15.93,88.31 16.1,88.14
  Top Layer w0.254: CN2.1 15.93,88.19
  Inner1 w0.254: U1.8 50.03,18.28 51.18,19.43 51.18,21.59 22.61,50.17 22.61,81.79 v1(17.4,87)
C8: length 42.4
  Top Layer w0.254: 27.34,58.42 27.34,58.26 v1(28.45,57.15) 35.18,57.15 44.01,65.98 U9.2
  Inner1 w0.203: U1.43 37.21,53.72 33.78,57.15 v1(28.45,57.15)
C9: length 39.6
  Top Layer w0.152: U16.13 64.39,60.45 63.5,59.56 v1(63.5,56.52)
  Bottom Layer w0.203: U1.78 37.46,48.77 38.48,49.78 38.48,53.47 40,54.99 61.98,54.99 v1(63.5,56.52)
C10: length 33.5
  Top Layer w0.254: H19.5 36,60.96 27.34,60.96 ; 27.34,60.96 27.21,60.96 ; 27.34,60.96 27.21,61.09 ; 27.34,60.96 28.45,59.85 v1(28.45,59.82)
  Inner1 w0.254: v1(28.45,59.82) 27.56,58.93 27.56,54.61 28.19,53.97 33.78,53.97 34.67,53.09 U1.42
C11: length 35.5
  Top Layer w0.254: 27.21,63.63 27.39,63.45 ; 27.39,63.45 27.21,63.45 ; 27.39,63.45 28.45,62.39 v1(28.45,62.36) ; 27.39,63.45 35.95,63.45 H19.3
  Inner1 w0.254: v1(28.45,62.36) 26.8,60.71 26.8,54.1 27.56,53.34 32.89,53.34 33.4,52.83 33.4,50.03 U1.79
C12: length 28.8
  Top Layer w0.254: H19.1 36.13,66.17 27.21,66.17 28.45,64.93 v1(28.45,64.9)
  Inner2 w0.254: U1.80 32.13,48.77 30.48,50.42 30.48,62.86 v1(28.45,64.9)
CTP_INT: length 27.1
  Top Layer w0.152: v1(51.94,10.92) 40.13,10.92 39.83,10.62 FPC1.13
  Bottom Layer w0.152: v1(51.94,10.92) 53.85,10.92 56.26,13.34 56.26,19.81 55.25,20.82 U1.31
D0: length 17.4
  Top Layer w0.152: U1.53 62.61,62.61 64.26,64.26 U16.10
D1: length 22.7
  Top Layer w0.152: U1.68 61.34,50.03 61.34,63.37 63.5,65.53 U16.9
D2: length 30.8
  Top Layer w0.254: v1(28.45,67.44) 28.45,67.47 27.21,68.71 31.37,68.71 34.01,71.35 U9.6
  Inner2 w0.254: v1(28.45,67.44) 32.13,63.75 U1.41
D5: length 67.2
  Top Layer w0.254: v1(28.32,86.61) 28.24,86.61 26.97,87.88 28.32,87.88 34.04,82.17 39.24,82.17 H18.5 ; U1.51 v1(57.53,57.4)
  Bottom Layer w0.254: v1(57.53,57.4) v1(28.32,86.61)
D6: length 100.8
  Top Layer w0.254: v1(28.19,84.2) 28.12,84.2 26.97,85.34 28.45,85.34 32.26,81.53 41.28,81.53 44.01,84.27 U10.2
  Bottom Layer w0.203: v1(28.19,84.2) 26.8,84.2 25.27,82.68 25.27,49.28 27.69,46.86 55.63,46.86 57.53,48.77 U1.70
D7: length 90.4
  Top Layer w0.254: U10.1 46.51,85.12 42.16,80.77 30.48,80.77 28.32,82.93 26.97,82.93 28.12,81.79 v1(28.19,81.79)
  Bottom Layer w0.203: v1(28.19,81.79) 28.19,70.1 35.94,62.36 35.94,48.01 36.45,47.5 53.09,47.5 53.72,48.13 53.72,50.04 54.99,51.31 U1.50
D8: length 30.9
  Inner1 w0.152: H4.1 92.07,10.54 92.07,14.48 89.15,17.4 83.43,17.4 81.27,19.56 74.04,19.56 U1.17 ; H12.4 96.63,9.27 93.6,9.27
D9: length 31
  Inner1 w0.152: 93.47,11.94 H5.2 ; 93.47,11.94 93.34,12.06 93.34,19.71 90.71,22.35 76.84,22.35 U1.23 ; 93.47,11.94 93.6,11.81 ; H12.3 93.73,11.94
D10: length 18.8
  Inner1 w0.152: U1.18 78.74,14.86 82.17,14.86 84.58,12.45 H14.10
E3: length 51.5
  Top Layer w0.254: 27.34,55.75 35.43,55.75 46.51,66.83 U9.1 ; 27.34,55.75 28.45,54.64 v1(28.45,54.61) ; 27.34,55.75 27.21,55.88 ; 27.34,55.75 27.21,55.75
  Inner2 w0.203: U1.77 38.1,47.12 31.24,47.12 29.72,48.64 29.72,53.34 v1(28.45,54.61)
E8: length 25.7
  Top Layer w0.152: v1(51.94,13.46) 38.1,13.46 37.33,12.7 FPC1.8
  Bottom Layer w0.152: v1(51.94,13.46) 53.97,13.46 54.99,14.48 U1.10
E9: length 32.6
  Top Layer w0.152: U1.30 57.53,20.7 56.26,19.43 56.26,16.83 55.69,16.26 35.94,16.26 34.83,15.15 FPC1.3
E10: length 30.2
  Top Layer w0.152: U1.11 57.53,16.76 56.51,15.75 36.19,15.75 35.33,14.89 FPC1.4
E11: length 33.8
  Top Layer w0.152: FPC1.5 35.83,14.5 36.45,15.11 57.15,15.11 58.8,16.76 58.8,19.56 U1.29
E12: length 31.3
  Top Layer w0.152: FPC1.7 36.83,13.21 37.59,13.97 v1(57.91,13.97)
  Bottom Layer w0.152: v1(57.91,13.97) 59.06,13.97 60.07,14.99 U1.12
E13: length 35.7
  Top Layer w0.152: FPC1.9 37.83,12.05 38.74,12.95 60.45,12.95 63.88,16.38 63.88,19.56 U1.28
E14: length 33.6
  Top Layer w0.152: U1.13 62.61,16.76 60.45,14.6 37.21,14.6 36.33,13.73 FPC1.6
MOTOR1_M0: length 5.8
  Top Layer w0.254: H19.2 36.45,74.77 U9.5
MOTOR1_M1: length 5.8
  Top Layer w0.254: U9.4 39.01,69.04 H19.4
MOTOR1_M2: length 5.8
  Top Layer w0.254: H19.6 41.53,74.81 U9.3
MOTOR2_M0: length 5.6
  Top Layer w0.254: U10.5 36.45,92.55 H18.2
MOTOR2_M1: length 5.6
  Top Layer w0.254: H18.4 39.01,87.02 U10.4
MOTOR2_M2: length 5.6
  Top Layer w0.254: U10.3 41.53,92.59 H18.6
WIFI_CS: length 12.7
  Top Layer w0.254: R8.1 R9.1 H2.7
  Inner1 w0.152: H2.7 81.91,9.53 79.76,7.37 78.99,7.37 H14.4
WIFI_RXD: length 10.2
  Bottom Layer w0.152: H2.8 84.71,12.06 87.5,9.27 91.06,9.27
WIFI_TXD: length 13.1
  Bottom Layer w0.152: H2.6 81.1,13.72 87.38,13.72 89.28,11.81 91.06,11.81
$1N1047: length 2.6
  Top Layer w1.27: DC1.1 16.87,23.73 U4.2
$1N1464: length 2.3
  Top Layer w0.254: U3.4 6.53,42.16 R1.2
$1N1552: length 9.2
  Top Layer w0.254: D1.1 4.47,37.92 4.41,37.98 ; 4.41,37.98 C6.1 ; 4.41,37.98 R1.1 6.51,40.16 7.62,41.28 7.62,42.29 U3.5
$1N1848: length 4.6
  Top Layer w0.508: C9.1 10.97,44.58 C10.1 8.63,44.53 U3.1
$1N1857: length 12.7
  Top Layer w0.508: 11.32,37.91 8.56,40.66 U3.6 10.68,42.3 C10.2 10.97,42.58 C9.2
  Top Layer w0.762: U5.1 11.32,37.91 D2.1
$1N2145: length 7.4
  Top Layer w0.254: R2.1 4.59,47.64 4.44,47.79 ; R2.1 C11.1 ; R2.1 6.66,47.47 U3.3
$1N4604: length 2
  Top Layer w0.762: 12V.2 18.24,15.48 R5.2
$1N4630: length 2
  Top Layer w0.762: R6.2 5.33,15.45 5V.2
$1N5073: length 8.2
  Top Layer w0.254: Q1.3 84.57,31.75 U8.1 88.23,31.76 U7.2
$1N5102: length 2.7
  Top Layer w0.254: Q1.1 80.13,35.42 R7.2

## Copper pours and planes (outline as drawn; the poured copper is in the pictures)
GND on Top Layer: -3.81,102.36 102.11,102.36 107.82,96.65 107.82,2.41 103.5,-1.91 -8.64,-1.91 -8.64,97.54
GND on Bottom Layer: 101.73,106.93 108.71,99.95 108.71,0.25 102.87,-5.59 -8.89,-5.59 -8.89,105.54 -7.49,106.93

Small or netless copper shapes (teardrops, artwork), in the pictures only: 296 on Top Layer, 35 on Bottom Layer, 73 on Inner1, 31 on Inner2

## Text on the board
Top Silkscreen Layer: EN | 5V
